# Altium schematic sheet main.SchDoc
size A4
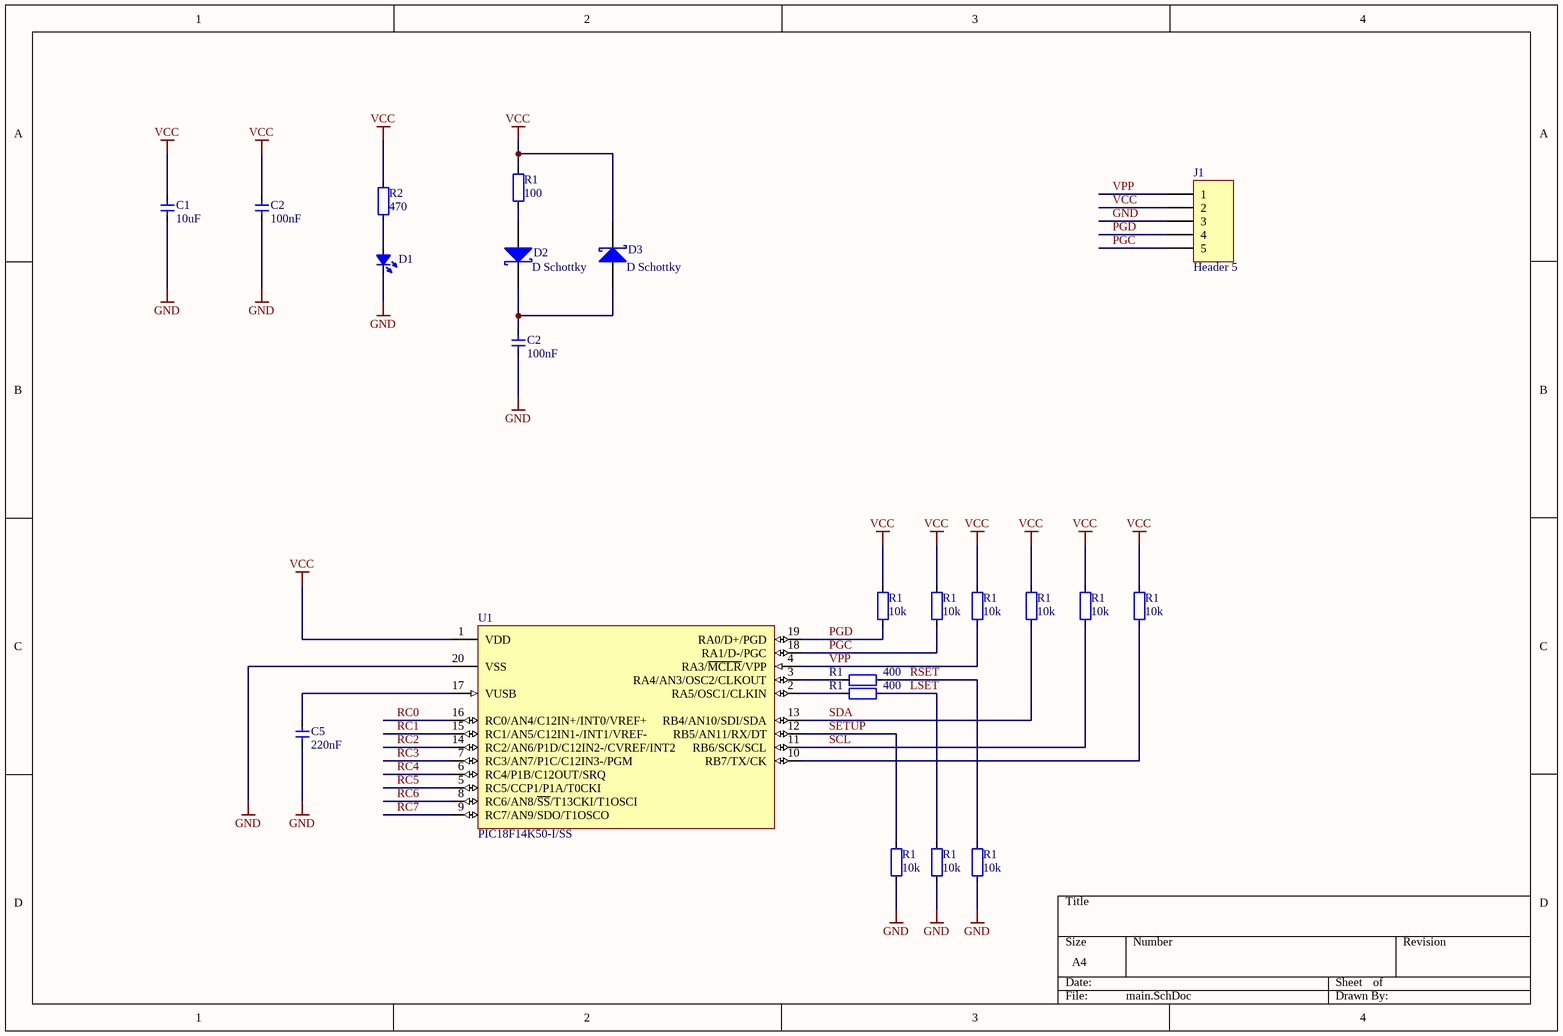
[diagram p0: main.SchDoc]

## Parts
(Parts that share a designator on the sheet are numbered #1, #2 ... from top to bottom, then left to right.)
C1  value 10uF  [CAP_0603]  (hidden comment: Cap_0603)
C2#1  value 100nF  [CAP_0603]  (hidden comment: Cap_0603)
C2#2  value 100nF  [CAP_0603]  (hidden comment: Cap_0603)
C5  value 220nF  [CAP_0603]  (hidden comment: Cap_0603)
D1  LED_0603  [LED_0603_RED]  (value not drawn)
D2  D Schottky  [SMB]
D3  D Schottky  [SMB]
J1  Header 5  [HDR1X5]
R1#1  value 100  [RES_0603]  (hidden comment: Res_0603)
R1#2  value 10k  [RES_0603]  (hidden comment: Res_0603)
R1#3  value 10k  [RES_0603]  (hidden comment: Res_0603)
R1#4  value 10k  [RES_0603]  (hidden comment: Res_0603)
R1#5  value 10k  [RES_0603]  (hidden comment: Res_0603)
R1#6  value 10k  [RES_0603]  (hidden comment: Res_0603)
R1#7  value 10k  [RES_0603]  (hidden comment: Res_0603)
R1#8  value 400  [RES_0603]  (hidden comment: Res_0603)
R1#9  value 400  [RES_0603]  (hidden comment: Res_0603)
R1#10  value 10k  [RES_0603]  (hidden comment: Res_0603)
R1#11  value 10k  [RES_0603]  (hidden comment: Res_0603)
R1#12  value 10k  [RES_0603]  (hidden comment: Res_0603)
R2  value 470  [RES_0603]  (hidden comment: Res_0603)
U1  PIC18F14K50-I/SS  [SSOP-SS20_N]

## Nets
GND: C1.1 C2#1.1 C2#2.1 C5.1 D1.2(K) J1.3 R1#10.1 R1#11.1 R1#12.1 U1.20(VSS)
VCC: C1.2 C2#1.2 D3.2(K) J1.2 R1#1.2 R1#2.2 R1#3.2 R1#4.2 R1#5.2 R1#6.2 R1#7.2 R2.2 U1.1(VDD)
LSET: R1#9.1 R1#11.2
PGC: J1.5 R1#3.1 U1.18(RA1/D-/PGC)
PGD: J1.4 R1#2.1 U1.19(RA0/D+/PGD)
RC0: U1.16(RC0/AN4/C12IN+/INT0/VREF+)
RC1: U1.15(RC1/AN5/C12IN1-/INT1/VREF-)
RC2: U1.14(RC2/AN6/P1D/C12IN2-/CVREF/INT2)
RC3: U1.7(RC3/AN7/P1C/C12IN3-/PGM)
RC4: U1.6(RC4/P1B/C12OUT/SRQ)
RC5: U1.5(RC5/CCP1/P1A/T0CKI)
RC6: U1.8(RC6/AN8/~{SS}/T13CKI/T1OSCI)
RC7: U1.9(RC7/AN9/SDO/T1OSCO)
RSET: R1#8.1 R1#12.2
SCL: R1#6.1 U1.11(RB6/SCK/SCL)
SDA: R1#5.1 U1.13(RB4/AN10/SDI/SDA)
SETUP: R1#10.2 U1.12(RB5/AN11/RX/DT)
VPP: J1.1 R1#4.1 U1.4(RA3/~{MCLR}/VPP)
NetC2#2_2: C2#2.2 D2.2(K) D3.1(A)
NetC5_2: C5.2 U1.17(VUSB)
NetD1_1: D1.1(A) R2.1
NetD2_1: D2.1(A) R1#1.1
NetR1#7_1: R1#7.1 U1.10(RB7/TX/CK)
NetR1#8_2: R1#8.2 U1.3(RA4/AN3/OSC2/CLKOUT)
NetR1#9_2: R1#9.2 U1.2(RA5/OSC1/CLKIN)

## Library data of the parts
C1 C2#1 C2#2 C5 = Cap_0603: Capacitor
D1 = LED_0603: LED
D2 D3 = D Schottky: Schottky Diode; Published: 8-Jun-2000; LatestRevisionDate: 17-Jul-2002; LatestRevisionNote: Re-released for DXP Platform.; PackageReference: SMB; Publisher: Altium Limited; PackageDescription: DO-214-AA/SMB; 2 C-Bend Leads; Body 5.3 x 3.6 mm, inc. leads (LxW); Code_JEDEC: DO-214-AA
J1 = Header 5: Header, 5-Pin; LatestRevisionDate: 17-Jul-2002; LatestRevisionNote: Re-released for DXP Platform.; Publisher: Altium Limited
R1#1-R1#12 R2 = Res_0603: Resistor
U1 = PIC18F14K50-I/SS: USB Flash Microcontroller with nanoWatt XLP Technology, 20-pin SSOP, Industrial Temperature; Published: 2-Dec-2009; DatasheetVersion: revC, Mar-2009; PackageVersion: revBB, Aug-2009; PackageReference: SSOP-SS20; Publisher: Altium Limited; PackageDescription: 20-Lead Plastic Shrink Small Outline (SS) - 5.3mm Body [SSOP]; Supplier 1: Digi-Key; Supplier Part Number 1: PIC18F14K50-I/SS-ND; Supplier 2: Farnell; Supplier Part Number 2: 1648504; Code_JEDEC: MO-150; Code_IPC: SOP65P780-20; ComponentLink1Description: Datasheet; ComponentLink1URL: http://ww1.microchip.com/downloads/en/DeviceDoc/41350C.pdf; ComponentLink2Description: Packaging Specification; ComponentLink2URL: http://www.microchip.com/stellent/groups/techpub_sg/documents/packagingspec/en012702.pdf; ComponentLink3Description: Microchip.com Home; ComponentLink3URL: http://www.microchip.com/